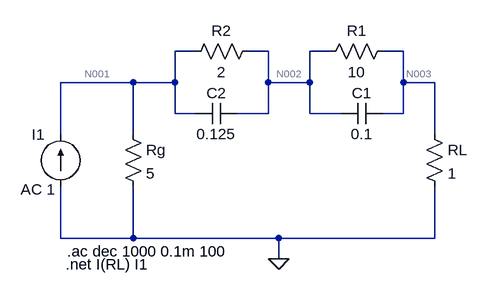
[diagram p0: schematic Ej1.asc]
Ej1.asc, the LTspice schematic file:
Version 4
SHEET 1 880 680
WIRE 176 80 144 80
WIRE 288 80 256 80
WIRE 384 80 352 80
WIRE 496 80 464 80
WIRE 80 128 -32 128
WIRE 144 128 144 80
WIRE 144 128 80 128
WIRE 288 128 288 80
WIRE 352 128 352 80
WIRE 352 128 288 128
WIRE 496 128 496 80
WIRE 544 128 496 128
WIRE 144 176 144 128
WIRE 176 176 144 176
WIRE 288 176 288 128
WIRE 288 176 240 176
WIRE 352 176 352 128
WIRE 400 176 352 176
WIRE 496 176 496 128
WIRE 496 176 464 176
WIRE -32 208 -32 128
WIRE 80 208 80 128
WIRE 544 208 544 128
WIRE -32 368 -32 288
WIRE 80 368 80 288
WIRE 80 368 -32 368
WIRE 304 368 80 368
WIRE 544 368 544 288
WIRE 544 368 304 368
WIRE 304 400 304 368
FLAG 304 400 0
SYMBOL res 528 192 R0
SYMATTR InstName RL
SYMATTR Value 1
SYMBOL cap 464 160 R90
WINDOW 0 0 32 VBottom 2
WINDOW 3 32 32 VTop 2
SYMATTR InstName C1
SYMATTR Value 0.1
SYMBOL cap 240 160 R90
WINDOW 0 0 32 VBottom 2
WINDOW 3 32 32 VTop 2
SYMATTR InstName C2
SYMATTR Value 0.125
SYMBOL res 480 64 R90
WINDOW 0 0 56 VBottom 2
WINDOW 3 32 56 VTop 2
SYMATTR InstName R1
SYMATTR Value 10
SYMBOL res 272 64 R90
WINDOW 0 0 56 VBottom 2
WINDOW 3 32 56 VTop 2
SYMATTR InstName R2
SYMATTR Value 2
SYMBOL res 64 192 R0
SYMATTR InstName Rg
SYMATTR Value 5
SYMBOL current -32 288 R180
WINDOW 0 24 80 Left 2
WINDOW 3 24 0 Left 2
WINDOW 123 8 -5 Left 2
WINDOW 39 0 0 Left 0
SYMATTR InstName I1
SYMATTR Value ""
SYMATTR Value2 AC 1
TEXT -24 408 Left 2 !.net I(RL) I1
TEXT -22 388 Left 2 !.ac dec 1000 0.1m 100

The netlist it stands for:
* Ej1.asc
RL N003 0 1
C1 N003 N002 0.1
C2 N002 N001 0.125
R1 N003 N002 10
R2 N002 N001 2
Rg N001 0 5
I1 0 N001 AC 1
.net I(RL) I1
.ac dec 1000 0.1m 100
.backanno
.end

* Results of the author's LTspice run, read from the files saved beside the schematic
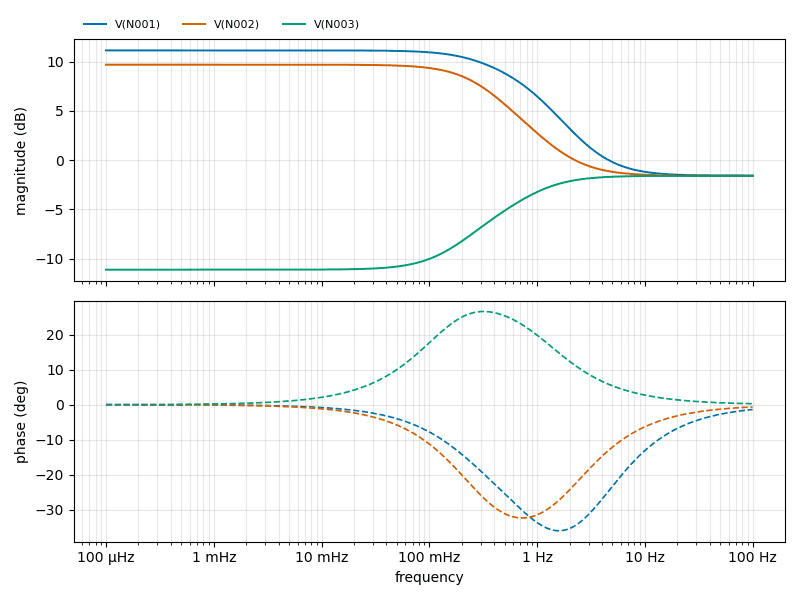
[diagram p1: AC Analysis of Ej1.asc, plotted from the saved traces]
* AC Analysis, 1 run:
*   V(N001): 11.15 dB at 100 µHz, -1.58 dB at 100 Hz, peak 11.15 dB at 100 µHz, 3 dB below the peak at 636.2 mHz
*   V(N002): 9.70 dB at 100 µHz, -1.58 dB at 100 Hz, peak 9.70 dB at 100 µHz, 3 dB below the peak at 385 mHz
*   V(N003): -11.13 dB at 100 µHz, -1.58 dB at 100 Hz, peak -1.58 dB at 100 Hz, 3 dB below the peak at 595.5 mHz